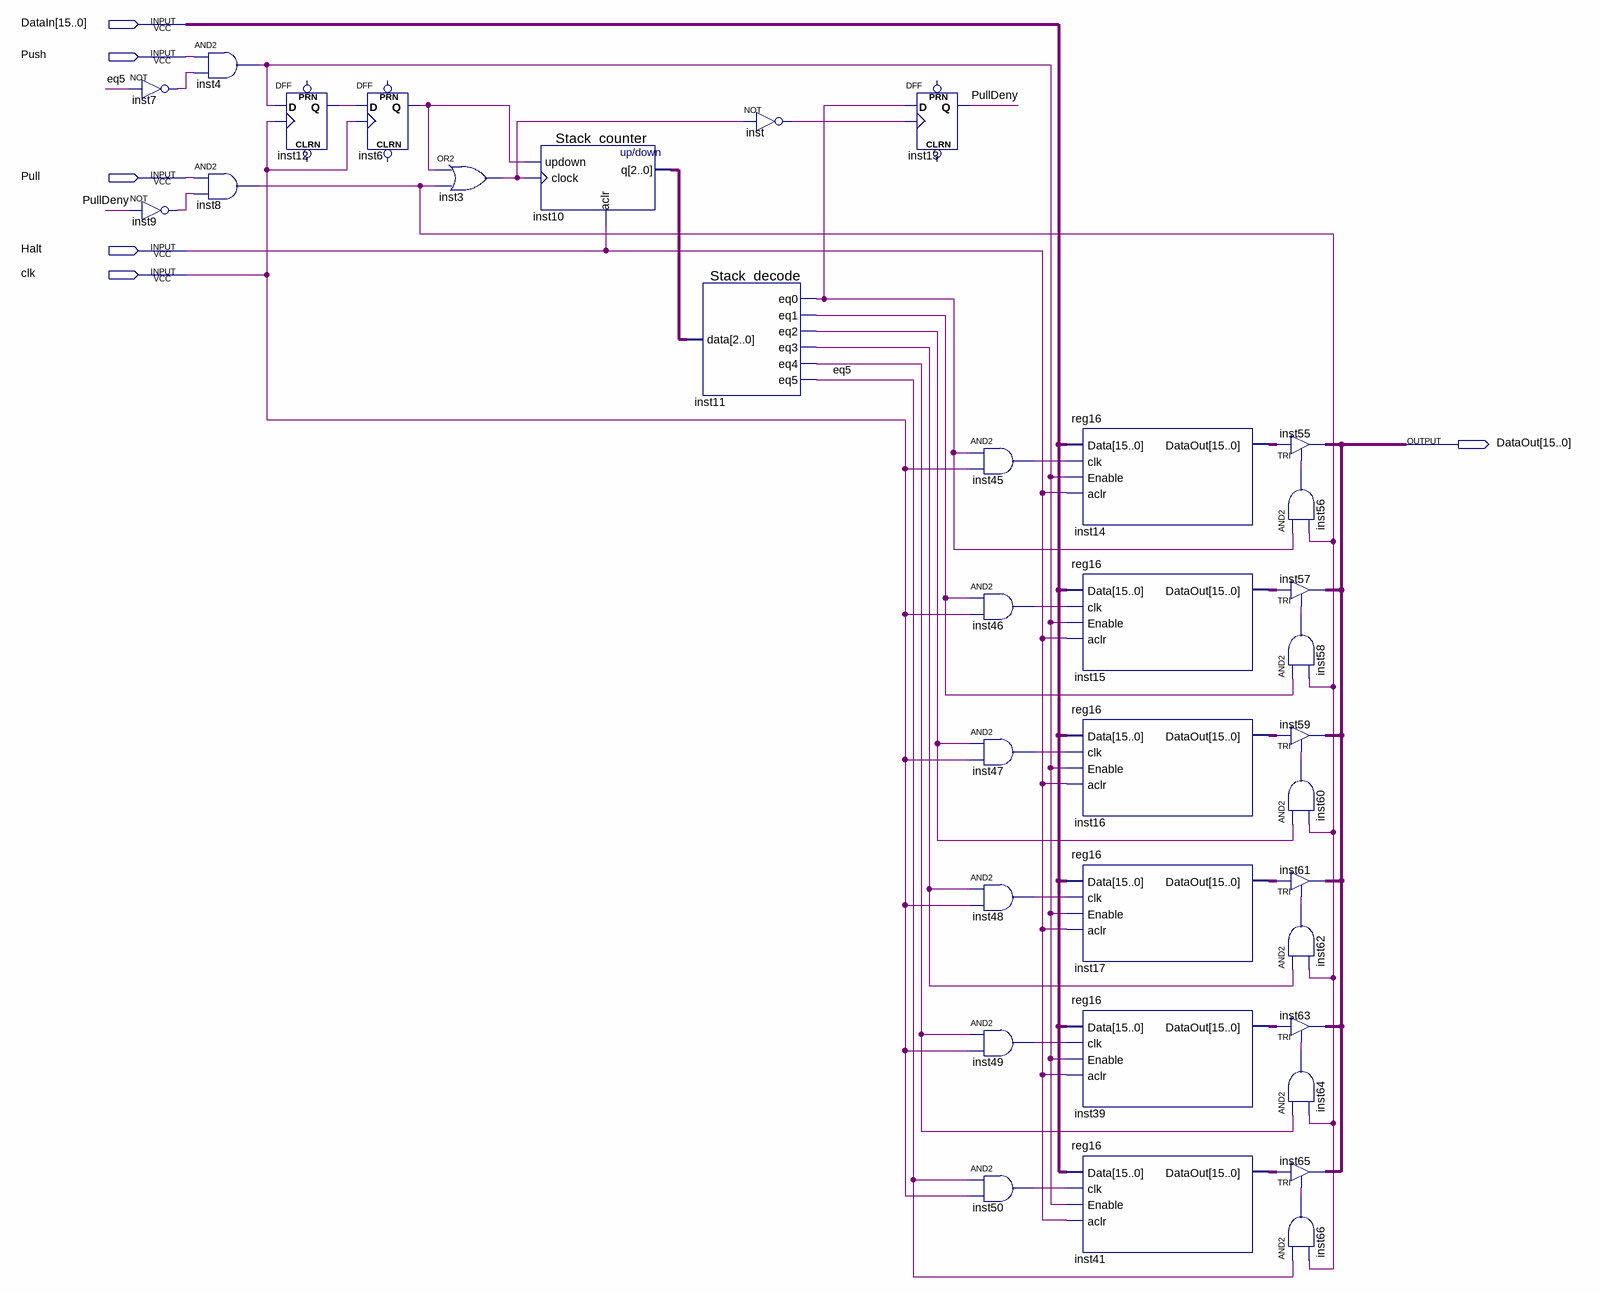
[diagram p0: schematic sheet]
// Quartus schematic StackUnit.bdf as structural Verilog: 35 symbols, 6 pins
module StackUnit (
  input  [15:0] DataIn,
  input  Push,
  input  Pull,
  input  Halt,
  input  clk,
  output [15:0] DataOut
);

  wire eq5, inst3_out, inst4_out, inst6_q, inst7_out, inst8_out, inst9_out, inst11_eq0, inst11_eq1,
       inst11_eq2, inst11_eq3, inst11_eq4, inst12_q, inst45_out, inst46_out, inst47_out, inst48_out,
       inst49_out, inst50_out, inst56_out, inst58_out, inst60_out, inst62_out, inst64_out, inst66_out,
       inst_out, PullDeny;
  wire [2:0] inst10_q;
  wire [15:0] inst14_dataout, inst15_dataout, inst16_dataout, inst17_dataout, inst39_dataout, inst41_dataout;

  not inst7 (inst7_out, eq5);
  not inst9 (inst9_out, PullDeny);
  and inst4 (inst4_out, Push, inst7_out);
  and inst8 (inst8_out, Pull, inst9_out);
  DFF inst12 (.CLK(clk), .D(inst4_out), .Q(inst12_q));  // open: CLRN, PRN
  DFF inst6 (.CLK(clk), .D(inst12_q), .Q(inst6_q));  // open: CLRN, PRN
  or inst3 (inst3_out, inst6_q, inst8_out);
  Stack_counter inst10 (.updown(inst6_q), .clock(inst3_out), .aclr(Halt), .q(inst10_q));
  Stack_decode inst11 (
    .data(inst10_q), .eq0(inst11_eq0), .eq1(inst11_eq1), .eq2(inst11_eq2), .eq3(inst11_eq3),
    .eq4(inst11_eq4), .eq5(eq5));
  not inst (inst_out, inst3_out);
  DFF inst13 (.CLK(inst_out), .D(inst11_eq0), .Q(PullDeny));  // open: CLRN, PRN
  and inst45 (inst45_out, inst11_eq0, clk);
  and inst46 (inst46_out, inst11_eq1, clk);
  and inst47 (inst47_out, inst11_eq2, clk);
  and inst48 (inst48_out, inst11_eq3, clk);
  and inst49 (inst49_out, inst11_eq4, clk);
  and inst50 (inst50_out, eq5, clk);
  reg16 inst14 (.Data(DataIn), .clk(inst45_out), .Enable(inst4_out), .aclr(Halt), .DataOut(inst14_dataout));
  reg16 inst15 (.Data(DataIn), .clk(inst46_out), .Enable(inst4_out), .aclr(Halt), .DataOut(inst15_dataout));
  reg16 inst16 (.Data(DataIn), .clk(inst47_out), .Enable(inst4_out), .aclr(Halt), .DataOut(inst16_dataout));
  reg16 inst17 (.Data(DataIn), .clk(inst48_out), .Enable(inst4_out), .aclr(Halt), .DataOut(inst17_dataout));
  reg16 inst39 (.Data(DataIn), .clk(inst49_out), .Enable(inst4_out), .aclr(Halt), .DataOut(inst39_dataout));
  reg16 inst41 (.Data(DataIn), .clk(inst50_out), .Enable(inst4_out), .aclr(Halt), .DataOut(inst41_dataout));
  TRI inst55[15:0] (.IN(inst14_dataout), .OE(inst56_out), .OUT(DataOut));
  and inst56 (inst56_out, inst11_eq0, inst8_out);
  TRI inst57[15:0] (.IN(inst15_dataout), .OE(inst58_out), .OUT(DataOut));
  and inst58 (inst58_out, inst11_eq1, inst8_out);
  TRI inst59[15:0] (.IN(inst16_dataout), .OE(inst60_out), .OUT(DataOut));
  and inst60 (inst60_out, inst11_eq2, inst8_out);
  TRI inst61[15:0] (.IN(inst17_dataout), .OE(inst62_out), .OUT(DataOut));
  and inst62 (inst62_out, inst11_eq3, inst8_out);
  TRI inst63[15:0] (.IN(inst39_dataout), .OE(inst64_out), .OUT(DataOut));
  and inst64 (inst64_out, inst11_eq4, inst8_out);
  TRI inst65[15:0] (.IN(inst41_dataout), .OE(inst66_out), .OUT(DataOut));
  and inst66 (inst66_out, eq5, inst8_out);
endmodule
